# Altium schematic sheet Sheet2.SchDoc
size A3
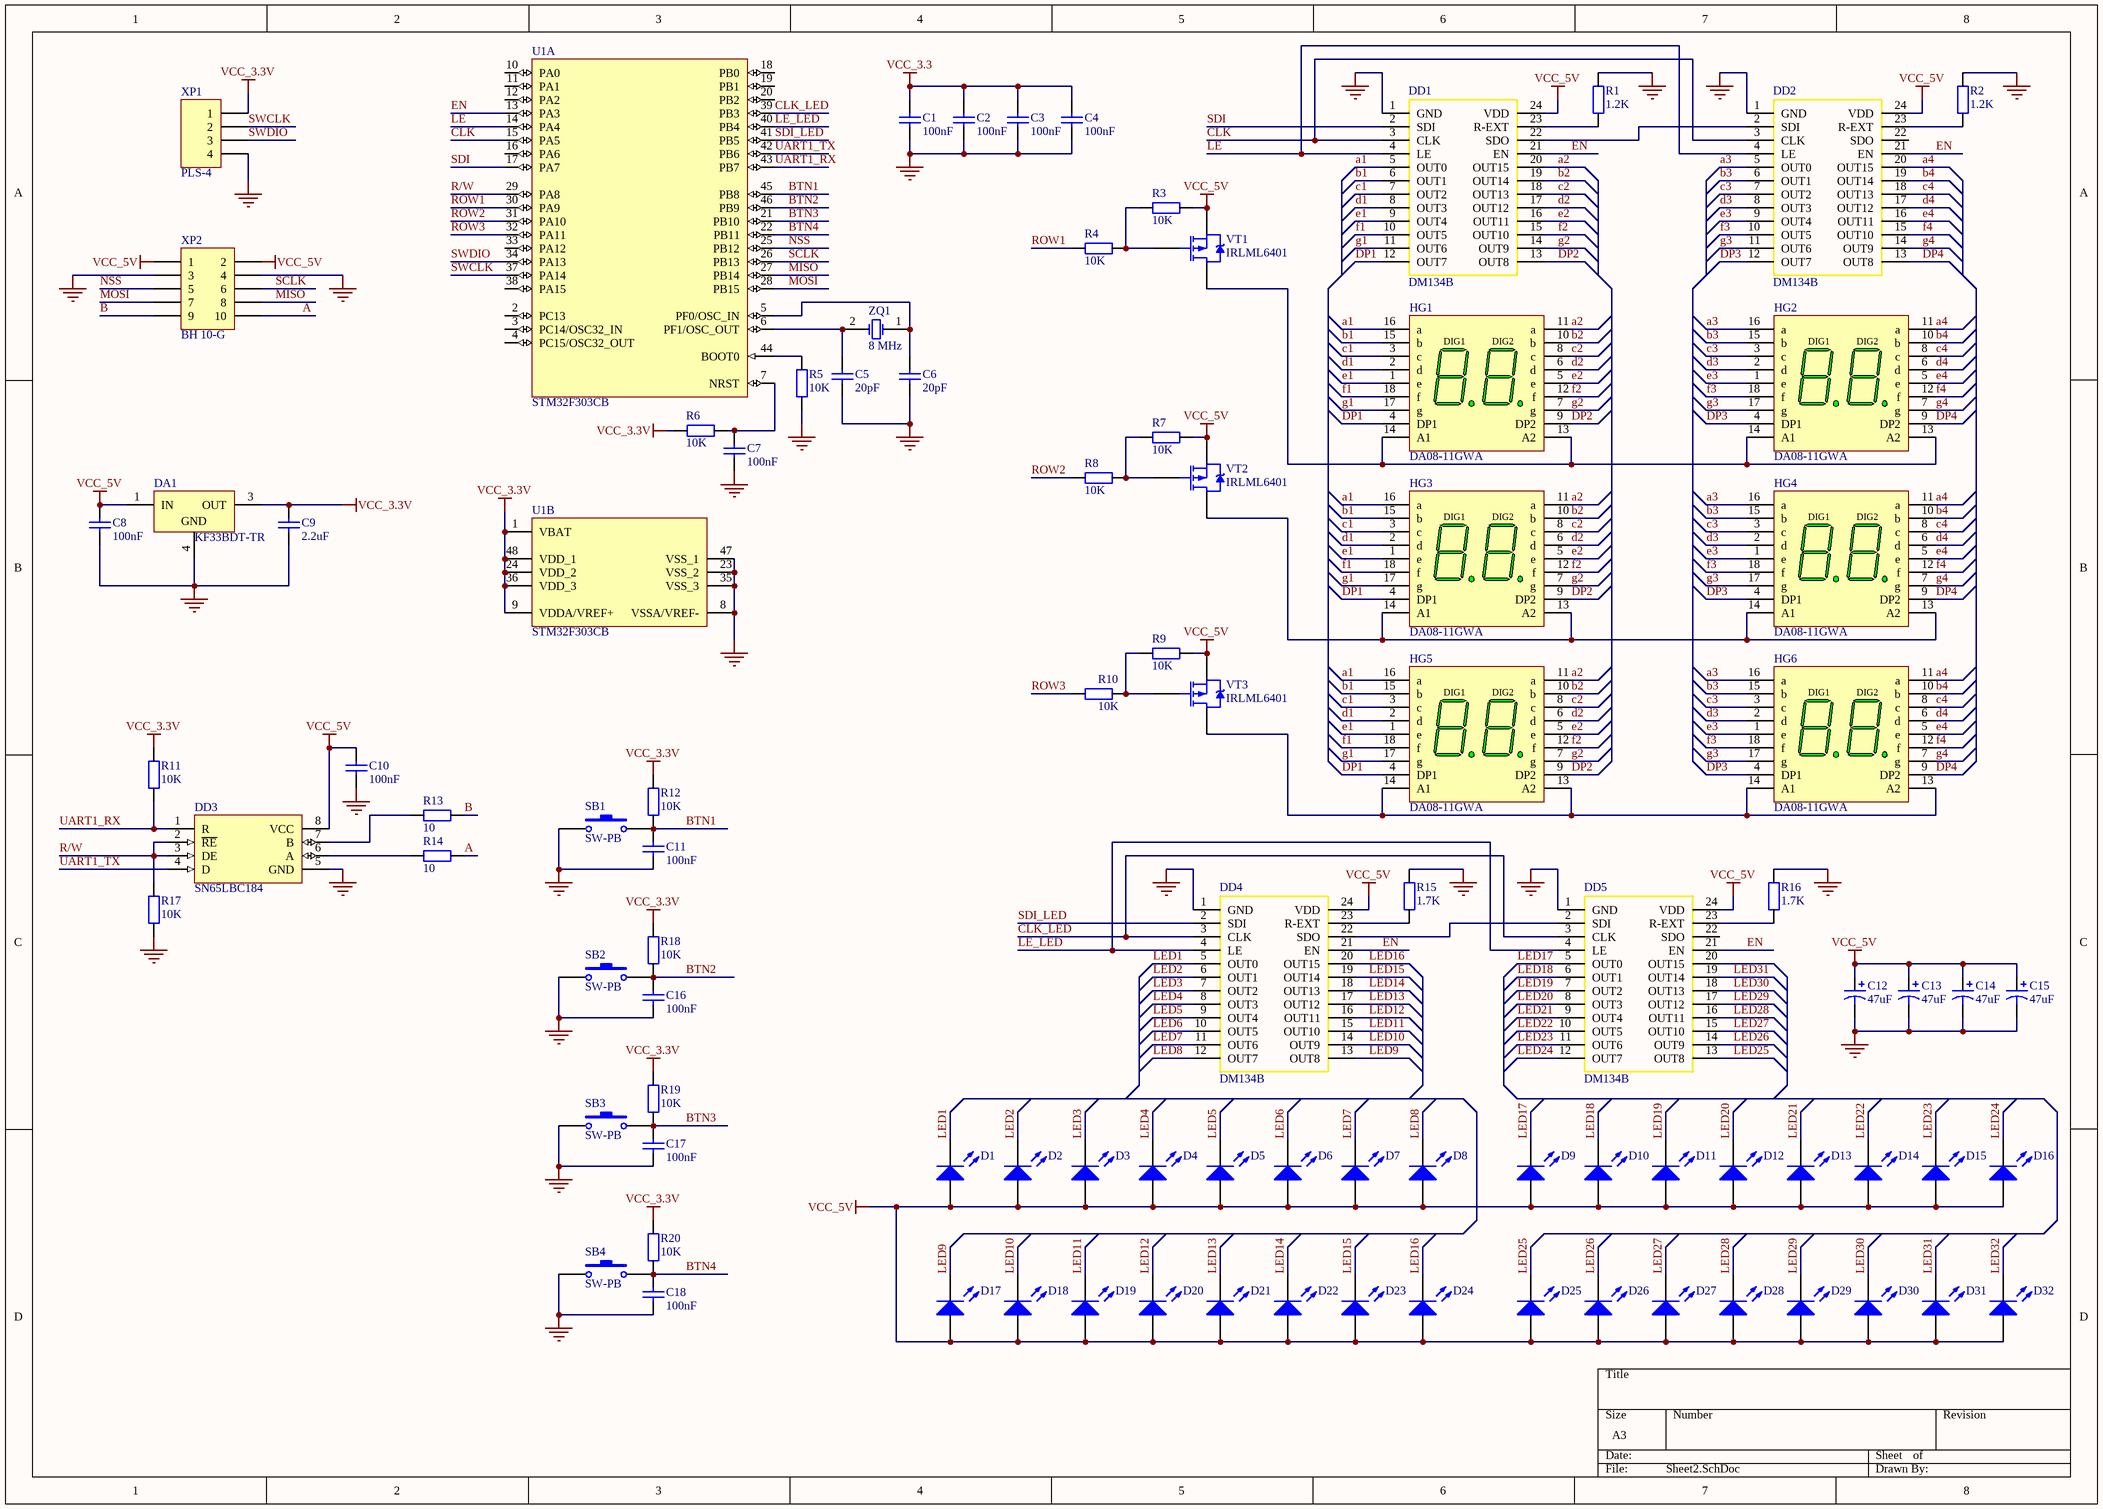
[diagram p0: Sheet2.SchDoc]

## Parts
C1  100nF  [RAD-0.3]
C2  100nF  [RAD-0.3]
C3  100nF  [RAD-0.3]
C4  100nF  [RAD-0.3]
C5  20pF  [RAD-0.3]
C6  20pF  [RAD-0.3]
C7  100nF  [RAD-0.3]
C8  100nF  [RAD-0.3]
C9  2.2uF  [RAD-0.3]
C10  100nF  [RAD-0.3]
C11  100nF  [RAD-0.3]
C12  47uF  [49BC-P]
C13  47uF  [49BC-P]
C14  47uF  [49BC-P]
C15  47uF  [49BC-P]
C16  100nF  [RAD-0.3]
C17  100nF  [RAD-0.3]
C18  100nF  [RAD-0.3]
D1  LED0  [LED-0]  (value not drawn)
D2  LED0  [LED-0]  (value not drawn)
D3  LED0  [LED-0]  (value not drawn)
D4  LED0  [LED-0]  (value not drawn)
D5  LED0  [LED-0]  (value not drawn)
D6  LED0  [LED-0]  (value not drawn)
D7  LED0  [LED-0]  (value not drawn)
D8  LED0  [LED-0]  (value not drawn)
D9  LED0  [LED-0]  (value not drawn)
D10  LED0  [LED-0]  (value not drawn)
D11  LED0  [LED-0]  (value not drawn)
D12  LED0  [LED-0]  (value not drawn)
D13  LED0  [LED-0]  (value not drawn)
D14  LED0  [LED-0]  (value not drawn)
D15  LED0  [LED-0]  (value not drawn)
D16  LED0  [LED-0]  (value not drawn)
D17  LED0  [LED-0]  (value not drawn)
D18  LED0  [LED-0]  (value not drawn)
D19  LED0  [LED-0]  (value not drawn)
D20  LED0  [LED-0]  (value not drawn)
D21  LED0  [LED-0]  (value not drawn)
D22  LED0  [LED-0]  (value not drawn)
D23  LED0  [LED-0]  (value not drawn)
D24  LED0  [LED-0]  (value not drawn)
D25  LED0  [LED-0]  (value not drawn)
D26  LED0  [LED-0]  (value not drawn)
D27  LED0  [LED-0]  (value not drawn)
D28  LED0  [LED-0]  (value not drawn)
D29  LED0  [LED-0]  (value not drawn)
D30  LED0  [LED-0]  (value not drawn)
D31  LED0  [LED-0]  (value not drawn)
D32  LED0  [LED-0]  (value not drawn)
DA1  KF33BDT-TR  [TO-252_N]
DD1  DM134B  [SSOP24]
DD2  DM134B  [SSOP24]
DD3  SN65LBC184  [D008_N]
DD4  DM134B  [SSOP24]
DD5  DM134B  [SSOP24]
HG1  DA08-11GWA  [DUAL_DIGIT_NUMERIC_08]
HG2  DA08-11GWA  [DUAL_DIGIT_NUMERIC_08]
HG3  DA08-11GWA  [DUAL_DIGIT_NUMERIC_08]
HG4  DA08-11GWA  [DUAL_DIGIT_NUMERIC_08]
HG5  DA08-11GWA  [DUAL_DIGIT_NUMERIC_08]
HG6  DA08-11GWA  [DUAL_DIGIT_NUMERIC_08]
R1  1.2K  [Res_0805]
R2  1.2K  [Res_0805]
R3  10K  [Res_0805]
R4  10K  [Res_0805]
R5  10K  [Res_0805]
R6  10K  [Res_0805]
R7  10K  [Res_0805]
R8  10K  [Res_0805]
R9  10K  [Res_0805]
R10  10K  [Res_0805]
R11  10K  [Res_0805]
R12  10K  [Res_0805]
R13  10  [Res_0805]
R14  10  [Res_0805]
R15  1.7K  [Res_0805]
R16  1.7K  [Res_0805]
R17  10K  [Res_0805]
R18  10K  [Res_0805]
R19  10K  [Res_0805]
R20  10K  [Res_0805]
SB1  SW-PB  [SPST-2]
SB2  SW-PB  [SPST-2]
SB3  SW-PB  [SPST-2]
SB4  SW-PB  [SPST-2]
U1  STM32F303CB  [LQFP48_M]  (parts A,B of 2)
VT1  IRLML6401  [Micro3_L]
VT2  IRLML6401  [Micro3_L]
VT3  IRLML6401  [Micro3_L]
XP1  PLS-4  [HDR1X4]
XP2  BH 10-G  [HDR2X5]
ZQ1  8 MHz  [HC49/4H_SMX]

## Nets
NetC1_1: C1.1 C2.1 C3.1 C4.1 C5.1 C6.1 C7.1 C8.1 C9.1 C10.2 C11.1 C12.2 C13.2 C14.2 C15.2 C16.1 C17.1 C18.1 DA1.4(GND) DD1.1(GND) DD2.1(GND) DD3.5(GND) DD4.1(GND) DD5.1(GND) R1.1 R2.1 R5.2 R15.1 R16.1 R17.1 SB1.2 SB2.2 SB3.2 SB4.2 U1.8(VSSA/VREF-) U1.23(VSS_2) U1.35(VSS_3) U1.47(VSS_1) XP1.4 XP2.3 XP2.4
VCC_3.3: C1.2 C2.2 C3.2 C4.2
VCC_3.3V: C9.2 DA1.3(OUT) R6.2 R11.2 R12.2 R18.2 R19.2 R20.2 U1.1(VBAT) U1.9(VDDA/VREF+) U1.24(VDD_2) U1.36(VDD_3) U1.48(VDD_1) XP1.1
VCC_5V: C8.2 C10.1 C12.1 C13.1 C14.1 C15.1 D1.1(A) D2.1(A) D3.1(A) D4.1(A) D5.1(A) D6.1(A) D7.1(A) D8.1(A) D9.1(A) D10.1(A) D11.1(A) D12.1(A) D13.1(A) D14.1(A) D15.1(A) D16.1(A) D17.1(A) D18.1(A) D19.1(A) D20.1(A) D21.1(A) D22.1(A) D23.1(A) D24.1(A) D25.1(A) D26.1(A) D27.1(A) D28.1(A) D29.1(A) D30.1(A) D31.1(A) D32.1(A) DA1.1(IN) DD1.24(VDD) DD2.24(VDD) DD3.8(VCC) DD4.24(VDD) DD5.24(VDD) R3.2 R7.2 R9.2 VT1.2(S) VT2.2(S) VT3.2(S) XP2.1 XP2.2
A: R14.1 XP2.10
a1: DD1.5(OUT0) HG1.16(a) HG3.16(a) HG5.16(a)
a2: DD1.20(OUT15) HG1.11(a) HG3.11(a) HG5.11(a)
a3: DD2.5(OUT0) HG2.16(a) HG4.16(a) HG6.16(a)
a4: DD2.20(OUT15) HG2.11(a) HG4.11(a) HG6.11(a)
B: R13.1 XP2.9
b1: DD1.6(OUT1) HG1.15(b) HG3.15(b) HG5.15(b)
b2: DD1.19(OUT14) HG1.10(b) HG3.10(b) HG5.10(b)
b3: DD2.6(OUT1) HG2.15(b) HG4.15(b) HG6.15(b)
b4: DD2.19(OUT14) HG2.10(b) HG4.10(b) HG6.10(b)
BTN1: C11.2 R12.1 SB1.1 U1.45(PB8)
BTN2: C16.2 R18.1 SB2.1 U1.46(PB9)
BTN3: C17.2 R19.1 SB3.1 U1.21(PB10)
BTN4: C18.2 R20.1 SB4.1 U1.22(PB11)
c1: DD1.7(OUT2) HG1.3(c) HG3.3(c) HG5.3(c)
c2: DD1.18(OUT13) HG1.8(c) HG3.8(c) HG5.8(c)
c3: DD2.7(OUT2) HG2.3(c) HG4.3(c) HG6.3(c)
c4: DD2.18(OUT13) HG2.8(c) HG4.8(c) HG6.8(c)
CLK: DD1.3(CLK) DD2.3(CLK) U1.15(PA5)
CLK_LED: DD4.3(CLK) DD5.3(CLK) U1.39(PB3)
d1: DD1.8(OUT3) HG1.2(d) HG3.2(d) HG5.2(d)
d2: DD1.17(OUT12) HG1.6(d) HG3.6(d) HG5.6(d)
d3: DD2.8(OUT3) HG2.2(d) HG4.2(d) HG6.2(d)
d4: DD2.17(OUT12) HG2.6(d) HG4.6(d) HG6.6(d)
DP1: DD1.12(OUT7) HG1.4(DP1) HG3.4(DP1) HG5.4(DP1)
DP2: DD1.13(OUT8) HG1.9(DP2) HG3.9(DP2) HG5.9(DP2)
DP3: DD2.12(OUT7) HG2.4(DP1) HG4.4(DP1) HG6.4(DP1)
DP4: DD2.13(OUT8) HG2.9(DP2) HG4.9(DP2) HG6.9(DP2)
e1: DD1.9(OUT4) HG1.1(e) HG3.1(e) HG5.1(e)
e2: DD1.16(OUT11) HG1.5(e) HG3.5(e) HG5.5(e)
e3: DD2.9(OUT4) HG2.1(e) HG4.1(e) HG6.1(e)
e4: DD2.16(OUT11) HG2.5(e) HG4.5(e) HG6.5(e)
EN: DD1.21(EN) DD2.21(EN) DD4.21(EN) DD5.21(EN) U1.13(PA3)
f1: DD1.10(OUT5) HG1.18(f) HG3.18(f) HG5.18(f)
f2: DD1.15(OUT10) HG1.12(f) HG3.12(f) HG5.12(f)
f3: DD2.10(OUT5) HG2.18(f) HG4.18(f) HG6.18(f)
f4: DD2.15(OUT10) HG2.12(f) HG4.12(f) HG6.12(f)
g1: DD1.11(OUT6) HG1.17(g) HG3.17(g) HG5.17(g)
g2: DD1.14(OUT9) HG1.7(g) HG3.7(g) HG5.7(g)
g3: DD2.11(OUT6) HG2.17(g) HG4.17(g) HG6.17(g)
g4: DD2.14(OUT9) HG2.7(g) HG4.7(g) HG6.7(g)
LE: DD1.4(LE) DD2.4(LE) U1.14(PA4)
LE_LED: DD4.4(LE) DD5.4(LE) U1.40(PB4)
LED1: D1.2(K) DD4.5(OUT0)
LED2: D2.2(K) DD4.6(OUT1)
LED3: D3.2(K) DD4.7(OUT2)
LED4: D4.2(K) DD4.8(OUT3)
LED5: D5.2(K) DD4.9(OUT4)
LED6: D6.2(K) DD4.10(OUT5)
LED7: D7.2(K) DD4.11(OUT6)
LED8: D8.2(K) DD4.12(OUT7)
LED9: D17.2(K) DD4.13(OUT8)
LED10: D18.2(K) DD4.14(OUT9)
LED11: D19.2(K) DD4.15(OUT10)
LED12: D20.2(K) DD4.16(OUT11)
LED13: D21.2(K) DD4.17(OUT12)
LED14: D22.2(K) DD4.18(OUT13)
LED15: D23.2(K) DD4.19(OUT14)
LED16: D24.2(K) DD4.20(OUT15)
LED17: D9.2(K) DD5.5(OUT0)
LED18: D10.2(K) DD5.6(OUT1)
LED19: D11.2(K) DD5.7(OUT2)
LED20: D12.2(K) DD5.8(OUT3)
LED21: D13.2(K) DD5.9(OUT4)
LED22: D14.2(K) DD5.10(OUT5)
LED23: D15.2(K) DD5.11(OUT6)
LED24: D16.2(K) DD5.12(OUT7)
LED25: D25.2(K) DD5.13(OUT8)
LED26: D26.2(K) DD5.14(OUT9)
LED27: D27.2(K) DD5.15(OUT10)
LED28: D28.2(K) DD5.16(OUT11)
LED29: D29.2(K) DD5.17(OUT12)
LED30: D30.2(K) DD5.18(OUT13)
LED31: D31.2(K) DD5.19(OUT14)
LED32: D32.2(K)
MISO: U1.27(PB14) XP2.8
MOSI: U1.28(PB15) XP2.7
NSS: U1.25(PB12) XP2.5
R/W: DD3.2(~{RE}) DD3.3(DE) R17.2 U1.29(PA8)
ROW1: R4.1 U1.30(PA9)
ROW2: R8.1 U1.31(PA10)
ROW3: R10.1 U1.32(PA11)
SCLK: U1.26(PB13) XP2.6
SDI: DD1.2(SDI) U1.17(PA7)
SDI_LED: DD4.2(SDI) U1.41(PB5)
SWCLK: U1.37(PA14) XP1.2
SWDIO: U1.34(PA13) XP1.3
UART1_RX: DD3.1(R) R11.1 U1.43(PB7)
UART1_TX: DD3.4(D) U1.42(PB6)
NetC5_2: C5.2 U1.6(PF1/OSC_OUT) ZQ1.2(OSC2)
NetC6_2: C6.2 U1.5(PF0/OSC_IN) ZQ1.1(OSC1)
NetC7_2: C7.2 R6.1 U1.7(NRST)
NetDD1_22: DD1.22(SDO) DD2.2(SDI)
NetDD1_23: DD1.23(R-EXT) R1.2
NetDD2_23: DD2.23(R-EXT) R2.2
NetDD3_6: DD3.6(A) R14.2
NetDD3_7: DD3.7(B) R13.2
NetDD4_22: DD4.22(SDO) DD5.2(SDI)
NetDD4_23: DD4.23(R-EXT) R15.2
NetDD5_23: DD5.23(R-EXT) R16.2
NetHG1_13: HG1.13(A2) HG1.14(A1) HG2.13(A2) HG2.14(A1) VT1.3(D)
NetHG3_13: HG3.13(A2) HG3.14(A1) HG4.13(A2) HG4.14(A1) VT2.3(D)
NetHG5_13: HG5.13(A2) HG5.14(A1) HG6.13(A2) HG6.14(A1) VT3.3(D)
NetR3_1: R3.1 R4.2 VT1.1(G)
NetR5_1: R5.1 U1.44(BOOT0)
NetR7_1: R7.1 R8.2 VT2.1(G)
NetR9_1: R9.1 R10.2 VT3.1(G)

Not connected (* = marked no-connect by the designer): DD2 22(SDO); DD5 20(OUT15) 22(SDO); U1 2(PC13) 3(PC14/OSC32_IN) 4(PC15/OSC32_OUT) 10(PA0) 11(PA1) 12(PA2) 16(PA6) 18(PB0) 19(PB1) 20(PB2) 33(PA12) 38(PA15)

## Notes on the sheet
- (in symbol DA08-11GWA) DIG1; DIG2

## Library data of the parts
C1-C4 C7 C8 C10 C11 C16-C18 = Cap: Capacitor; Value: 0.1uF; Published: 8-Jun-2000; LatestRevisionDate: 17-Jul-2002; LatestRevisionNote: Re-released for DXP Platform.; PackageReference: RAD-0.3; Publisher: Altium Limited; PackageDescription: Radial Cap, Thru-Hole; 2 Leads; 0.3 in Pin Spacing
C5 C6 C9 = Cap: Capacitor; Published: 8-Jun-2000; LatestRevisionDate: 17-Jul-2002; LatestRevisionNote: Re-released for DXP Platform.; PackageReference: RAD-0.3; Publisher: Altium Limited; PackageDescription: Radial Cap, Thru-Hole; 2 Leads; 0.3 in Pin Spacing
  C5 C6: Value: 20pF
  C9: Value: 2.2uF
C12-C15 = 49BC476B010M: Conformal Coated Solid Tantalum Chip Capacitor: 47uF, 20% Tolerance, 10 WVDC @ -55°C to +85°C, Surge = 13V; Note: See Data Sheet for full range of components; Published: 19-Mar-2004; DatasheetDocument: 05-Jul-2002; PackageReference: 49BC-P; Publisher: Altium Limited; ComponentLink1Description: Manufacturer Link; ComponentLink1URL: http://www.vishay.com/; Value: 47uF
D1-D32 = LED0: Typical INFRARED GaAs LED; Published: 8-Jun-2000; LatestRevisionDate: 08-Jul-2005; LatestRevisionNote: Mech Layer 1 removed.; PackageReference: LED-0; Publisher: Altium Limited; PackageDescription: LED; 2 Leads
DA1 = KF33BDT-TR: Very Low Drop Voltage Regulators with Inhibit, 3.3V, 3-Pin DPAK, Tape and Reel; DatasheetVersion: Feb-2008; PackageVersion: 2011; PackageReference: TO-252; PackageDescription: 3-Pin Transistor Outline Package 2.28 mm Pitch, 9.7 mm Lead Span (DPAK); PartNumber: KF33BDT-TR; ComponentLink1Description: Manufacturer URL; ComponentLink1URL: http://www.st.com; ComponentLink2Description: Datasheet; ComponentLink2URL: http://www.st.com/internet/com/TECHNICAL_RESOURCES/TECHNICAL_LITERATURE/DATASHEET/CD00000970.pdf
DD1 DD2 DD4 DD5 = DM134B: LED Driver; Type: LED Driver
DD3 = SN65LBC184: Interface RS-485
HG1-HG6 = DA08-11GWA: Двухсимвольный светодиодный индикатор
R1-R20 = Resistor
SB1-SB4 = SW-PB: Switch; Published: 24-Mar-1999; LatestRevisionDate: 17-Jul-2002; LatestRevisionNote: Re-released for DXP Platform.; PackageReference: SPST-2; Publisher: Altium Limited; PackageDescription: Switch; 2 Leads
U1 = STM32F303CB: STM32 ARM-based 32-bit MCU Value Line with 16 kB Flash, 4 kB Internal RAM, Internal Code B, -40 to +85°C Temperature, 48-Pin LQFP, Tray; DatasheetVersion: rev6.0, Apr-2011; PackageVersion: rev13, Apr-2011; PackageReference: LQFP48; PackageDescription: 48-Pin Low-Profile Quad Flat Pack, 7 x 7 mm Body, 0.5 mm Pitch (LQFP48); ComponentLink1Description: Manufacturer URL; ComponentLink1URL: http://www.st.com/; ComponentLink2Description: STM32F303 Datasheet; ComponentLink2URL: http://www.st.com/st-web-ui/static/active/en/resource/technical/document/datasheet/DM00058181.pdf; ComponentLink3Description: STM32 Family Web Page; ComponentLink3URL: www.st.com/stm32
VT1-VT3 = IRLML6401: HEXFET Power MOSFET; Published: 17-Sep-2003; DatasheetVersion: 2-Jul-2001; PackageVersion: Jul-2001; PackageReference: Micro3; Publisher: Altium Limited; PackageDescription: 3-Pin SOT-23 Package 0.95 mm Pitch, 2.3 mm Lead Span; ComponentLink1Description: Manufacturer Link; ComponentLink1URL: http://www.irf.com/; ComponentLink2Description: Datasheet; ComponentLink2URL: http://www.irf.com/product-info/datasheets/data/IRLML6401.pdf
XP1 = Header 4: Header, 4-Pin; LatestRevisionDate: 17-Jul-2002; LatestRevisionNote: Re-released for DXP Platform.; Publisher: Altium Limited
XP2 = Header 5X2: Header, 5-Pin, Dual row; LatestRevisionDate: 17-Jul-2002; LatestRevisionNote: Re-released for DXP Platform.; Publisher: Altium Limited
ZQ1 = XTAL: Crystal Oscillator; Published: 8-Jun-2000; LatestRevisionDate: 17-Jul-2002; LatestRevisionNote: Re-released for DXP Platform.; PackageReference: R38; Publisher: Altium Limited; PackageDescription: Crystal, Thru-Hole; 2 Leads; Body 3.1 x 8.2 mm (Dia.xH)